# EAGLE schematic Hello3 (EAGLE 6.2)
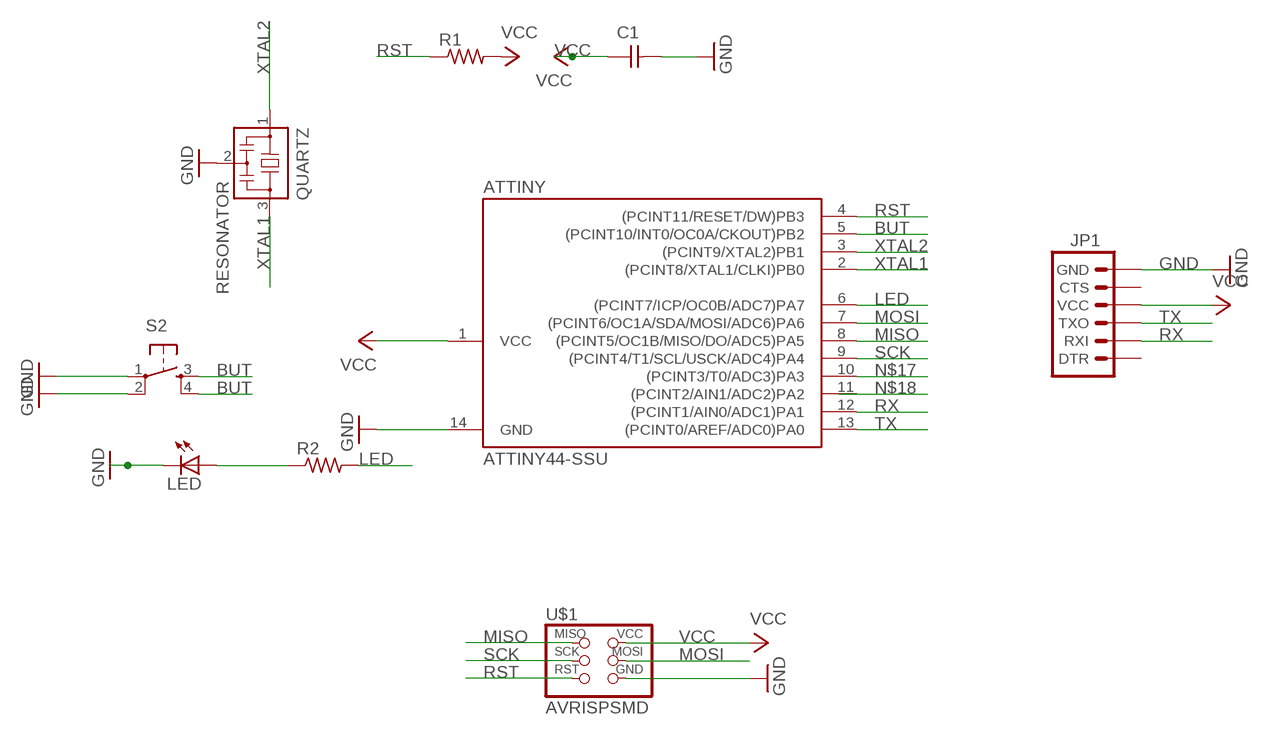
[diagram p0: schematic, sheet 1]

## Parts
ATTINY  ATTINY44-SSU  [SOIC14]
C1  UNPOLARIZED_CAPACITOR1206  [1206]
JP1  ARDUINO_SERIAL_PROGRAMLONGPADS  [1X06_LONGPADS]
LED  LED1206  [1206]
QUARTZ  RESONATOR  [EFOBM]
R1  RESISTOR1206  [1206]
R2  RESISTOR1206  [1206]
S2  6MM_SWITCH6MM_SWITCH  [6MM_SWITCH]
U$1  AVRISPSMD  [2X03SMD]

## Nets
BUT: ATTINY.5((PCINT10/INT0/OC0A/CKOUT)PB2) S2.3(S) S2.4(S1)
GND: ATTINY.14(GND) C1.2 JP1.6(GND) LED.2(C) QUARTZ.2 S2.1(P) S2.2(P1) U$1.6(GND)
LED: ATTINY.6((PCINT7/ICP/OC0B/ADC7)PA7) R2.2
LEDRES: LED.1(A) R2.1
MISO: ATTINY.8((PCINT5/OC1B/MISO/DO/ADC5)PA5) U$1.1(MISO)
MOSI: ATTINY.7((PCINT6/OC1A/SDA/MOSI/ADC6)PA6) U$1.4(MOSI)
N$17: ATTINY.10((PCINT3/T0/ADC3)PA3)
RST: ATTINY.4((PCINT11/RESET/DW)PB3) R1.1 U$1.5(RST)
RX: ATTINY.12((PCINT1/AIN0/ADC1)PA1) JP1.2(RXI)
SCK: ATTINY.9((PCINT4/T1/SCL/USCK/ADC4)PA4) U$1.3(SCK)
TX: ATTINY.13((PCINT0/AREF/ADC0)PA0) JP1.3(TXO)
VCC: ATTINY.1(VCC) C1.1 JP1.4(VCC) R1.2 U$1.2(VCC)
XTAL1: ATTINY.2((PCINT8/XTAL1/CLKI)PB0) QUARTZ.3
XTAL2: ATTINY.3((PCINT9/XTAL2)PB1) QUARTZ.1
Unconnected: ATTINY.11((PCINT2/AIN1/ADC2)PA2) JP1.1(DTR) JP1.5(CTS)

## Library data of the parts
ATTINY = fab:ATTINY44
C1 = FAB_Hello:UNPOLARIZED_CAPACITOR: unpolarized_capacitor
JP1 = SparkFun-Connectors:ARDUINO_SERIAL_PROGRAM: FTDI connector footprints
LED = ng:LED
QUARTZ = fab:RESONATOR
R1 R2 = ng:RESISTOR
S2 = fab:6MM_SWITCH: OMRON SWITCH
U$1 = fab:AVRISP